# Altium schematic sheet PL2303EVM.SchDoc
size A4
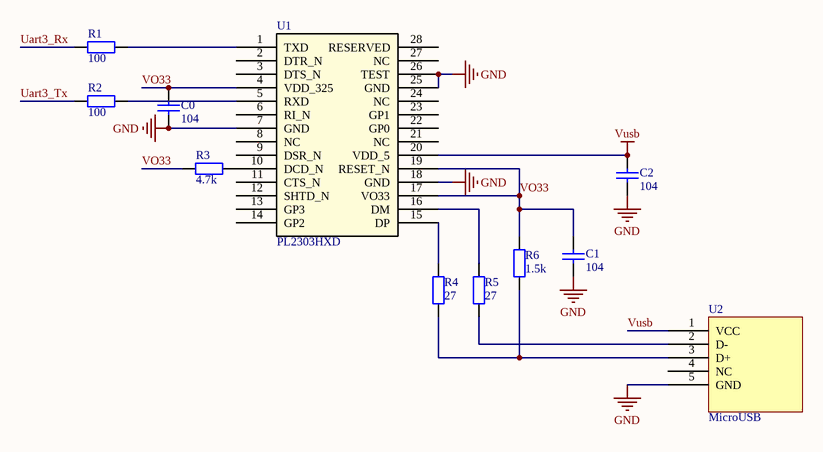
[diagram p0: PL2303EVM.SchDoc]

## Parts
C0  104  [0805]
C1  104  [0805]
C2  104  [0805]
R1  100  [0805]
R2  100  [0805]
R3  4.7k  [0805]
R4  27  [0805]
R5  27  [0805]
R6  1.5k  [0805]
U1  PL2303HXD  [SSOP28]
U2  MicroUSB  [USB/SM0.8-6H5]

## Nets
GND: C0.2 C1.2 C2.2 U1.7(GND) U1.18(GND) U1.25(GND) U1.26(TEST) U2.5(GND)
Vusb: C2.1 U1.20(VDD_5) U2.1(VCC)
Uart3_Rx: R1.2
Uart3_Tx: R2.2
VO33: C0.1 C1.1 R3.2 R6.2 U1.4(VDD_325) U1.17(VO33) U1.19(RESET_N)
NetR1_1: R1.1 U1.1(TXD)
NetR2_1: R2.1 U1.5(RXD)
NetR3_1: R3.1 U1.10(DCD_N)
NetR4_1: R4.1 R6.1 U2.3(D+)
NetR4_2: R4.2 U1.15(DP)
NetR5_1: R5.1 U2.2(D-)
NetR5_2: R5.2 U1.16(DM)

Not connected (* = marked no-connect by the designer): U1 2(DTR_N) 3(DTS_N) 6(RI_N) 8(NC) 9(DSR_N) 11(CTS_N) 12(SHTD_N) 13(GP3) 14(GP2) 21(NC) 22(GP0) 23(GP1) 24(NC) 27(NC) 28(RESERVED); U2 4(NC)

## Library data of the parts
C0-C2 = C: Capacitor; Published: 8-Jun-2000; LatestRevisionDate: 17-Jul-2002; LatestRevisionNote: Re-released for DXP Platform.; PackageReference: RAD-0.3; Publisher: Altium Limited; PackageDescription: Radial Cap, Thru-Hole; 2 Leads; 0.3 in Pin Spacing
R1-R6 = R: Resistor; Published: 8-Jun-2000; LatestRevisionDate: 17-Jul-2002; LatestRevisionNote: Re-released for DXP Platform.; PackageReference: AXIAL-0.4; Publisher: Altium Limited; PackageDescription: Axial Device, Thru-Hole; 2 Leads; 0.4 in Pin Spacing
U1 = PL2303HXD: Driver; Manufacturer_Part_Number: tlc5916-q1_d_16; GENERIC_PART_NUMBER: TLC5916-Q1; Vendor: Texas Instruments; PACKAGE_DESIGNATOR: D; PIN_COUNT: 16; FAMILY_NAME: LED DRIVER; INDUSTRY_STD_PKG_TYPE: SOIC; Manufacturer: Texas Instruments; Datasheet_URL: http://www.ti.com/lit/gpn/TLC5916-Q1; Value: Value; Type: Type; RefDes: RefDes